# Altium schematic sheet Shutdown.SchDoc
size Tabloid; SheetNumber: 3; SheetTotal: 4
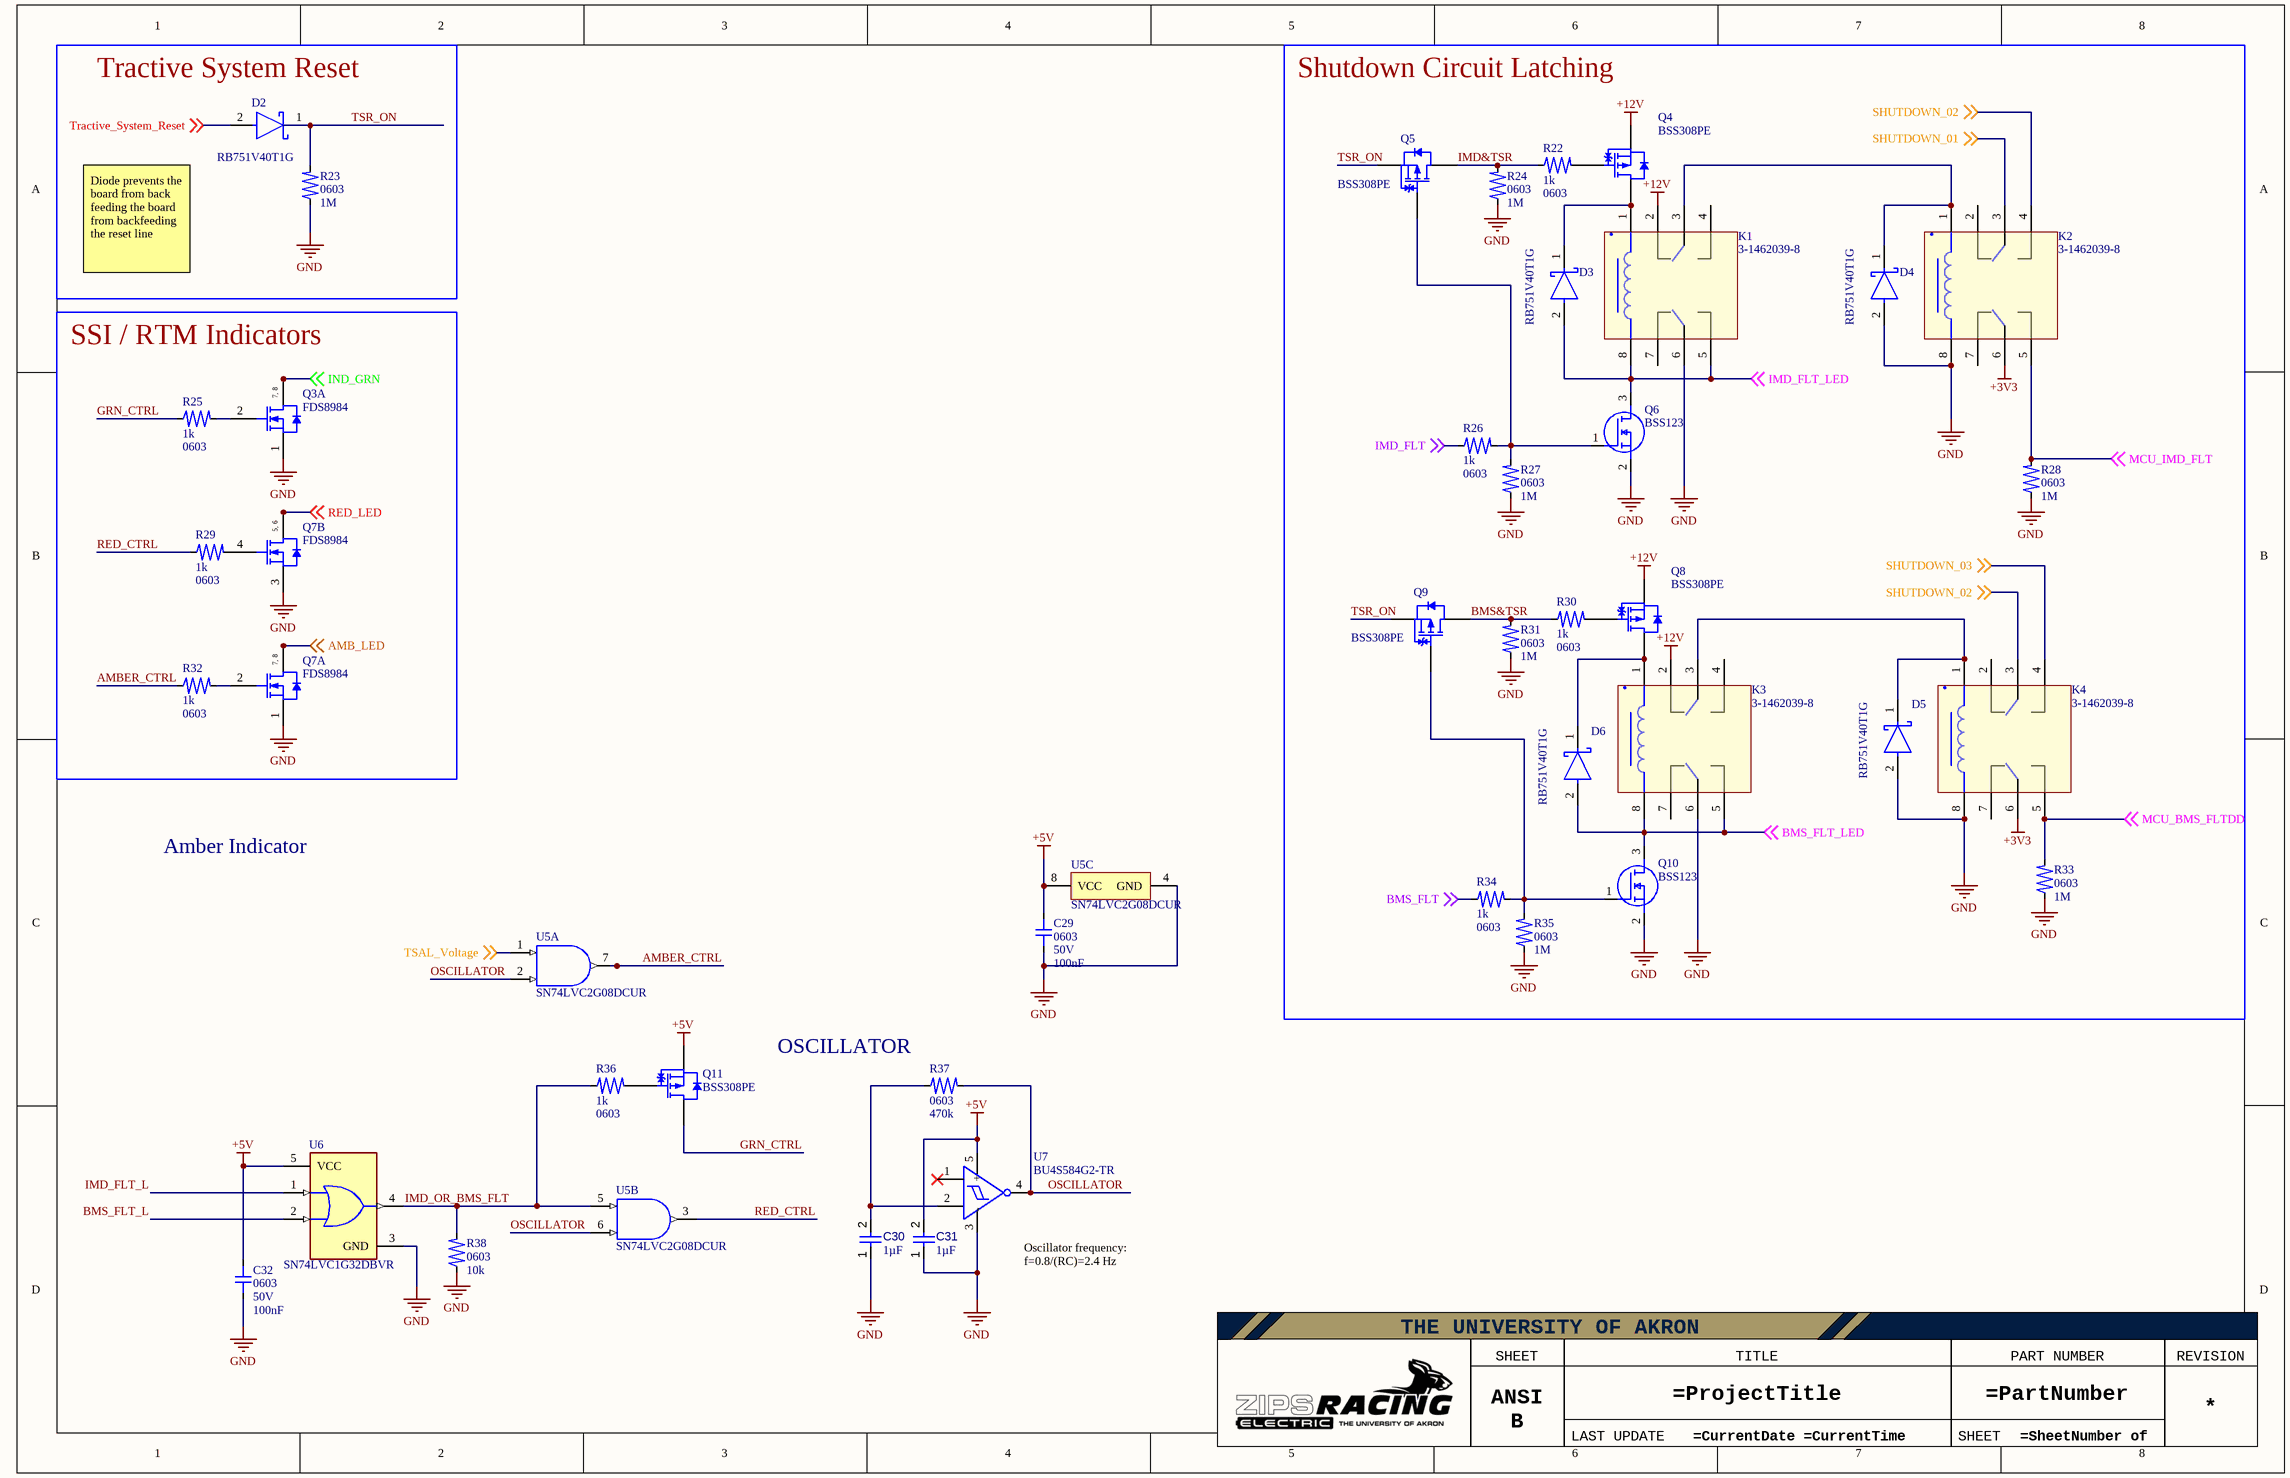
[diagram p0: Shutdown.SchDoc]

## Parts
C29  value 100nF  Footprint: 0603  Voltage: 50V  [CAP-0603-Generic]  (hidden comment: Capacitor 100nF 0603 5%)
C30  value 1µF  [CAPC1608X94X35NL15T15]  (hidden comment: Capacitor 1 uF +/- 10% 16 V 0603)
C31  value 1µF  [CAPC1608X94X35NL15T15]  (hidden comment: Capacitor 1 uF +/- 10% 16 V 0603)
C32  value 100nF  Footprint: 0603  Voltage: 50V  [CAP-0603-Generic]  (hidden comment: Capacitor 100nF 0603 5%)
D2  RB751V40T1G  [FP-477-02-MFG]
D3  RB751V40T1G  [FP-477-02-MFG]
D4  RB751V40T1G  [FP-477-02-MFG]
D5  RB751V40T1G  [FP-477-02-MFG]
D6  RB751V40T1G  [FP-477-02-MFG]
K1  3-1462039-8  [FP-3-1462039-8-MFG]
K2  3-1462039-8  [FP-3-1462039-8-MFG]
K3  3-1462039-8  [FP-3-1462039-8-MFG]
K4  3-1462039-8  [FP-3-1462039-8-MFG]
Q3  FDS8984  [FAIR-SOIC-8_V]  (part A of 2)
Q4  BSS308PE  [INF-PG-SOT23_M]
Q5  BSS308PE  [INF-PG-SOT23_M]
Q6  BSS123  [SOT96P237X111-3N]
Q7  FDS8984  [FAIR-SOIC-8_V]  (parts A,B of 2)
Q8  BSS308PE  [INF-PG-SOT23_M]
Q9  BSS308PE  [INF-PG-SOT23_M]
Q10  BSS123  [SOT96P237X111-3N]
Q11  BSS308PE  [INF-PG-SOT23_M]
R22  value 1k  Footprint: 0603  [RES-0603-Generic]  (hidden comment: Resistor 1k 0603 1%)
R23  value 1M  Footprint: 0603  [RES-0603-Generic]  (hidden comment: Resistor 1M 0603 1%)
R24  value 1M  Footprint: 0603  [RES-0603-Generic]  (hidden comment: Resistor 1M 0603 1%)
R25  value 1k  Footprint: 0603  [RES-0603-Generic]  (hidden comment: Resistor 1k 0603 1%)
R26  value 1k  Footprint: 0603  [RES-0603-Generic]  (hidden comment: Resistor 1k 0603 1%)
R27  value 1M  Footprint: 0603  [RES-0603-Generic]  (hidden comment: Resistor 1M 0603 1%)
R28  value 1M  Footprint: 0603  [RES-0603-Generic]  (hidden comment: Resistor 1M 0603 1%)
R29  value 1k  Footprint: 0603  [RES-0603-Generic]  (hidden comment: Resistor 1k 0603 1%)
R30  value 1k  Footprint: 0603  [RES-0603-Generic]  (hidden comment: Resistor 1k 0603 1%)
R31  value 1M  Footprint: 0603  [RES-0603-Generic]  (hidden comment: Resistor 1M 0603 1%)
R32  value 1k  Footprint: 0603  [RES-0603-Generic]  (hidden comment: Resistor 1k 0603 1%)
R33  value 1M  Footprint: 0603  [RES-0603-Generic]  (hidden comment: Resistor 1M 0603 1%)
R34  value 1k  Footprint: 0603  [RES-0603-Generic]  (hidden comment: Resistor 1k 0603 1%)
R35  value 1M  Footprint: 0603  [RES-0603-Generic]  (hidden comment: Resistor 1M 0603 1%)
R36  value 1k  Footprint: 0603  [RES-0603-Generic]  (hidden comment: Resistor 1k 0603 1%)
R37  value 470k  Footprint: 0603  [RES-0603-Generic]  (hidden comment: Resistor 470k 0603 1%)
R38  value 10k  Footprint: 0603  [RES-0603-Generic]  (hidden comment: Resistor 10k 0603 1%)
U5  SN74LVC2G08DCUR  [DCU0008A_N]  (parts A,B,C of 3)
U6  SN74LVC1G32DBVR  [FP-DBV0005A-MFG]
U7  BU4S584G2-TR  [SSOP5_ROM]

## Blocks framed on the sheet
Tractive System Reset: D2 R23
Shutdown Circuit Latching: D3-D6 K1-K4 Q4-Q6 Q8-Q10 R22 R24 R26-R28 R30 R31 R33-R35
SSI / RTM Indicators: Q3 Q7 R25 R29 R32

## Nets
+3V3: K2.6 K4.6
+5V: C29.2 C31.2 C32.2 Q11.2(SOURCE) U5.8(VCC) U6.5(VCC) U7.5(+)
+12V: K1.2 K3.2 Q4.2(SOURCE) Q8.2(SOURCE)
GND: C29.1 C30.1 C31.1 C32.1 D4.2(A) D5.2(A) K1.6 K2.8 K3.6 K4.8 Q3.1(S1) Q6.2(S) Q7.1(S1) Q7.3(S2) Q10.2(S) R23.1 R24.1 R27.1 R28.1 R31.1 R33.1 R35.1 R38.1 U5.4(GND) U6.3(GND) U7.3(-)
AMB_LED: Q7.7(D1) Q7.8(D1) ; off-sheet AMB_LED
AMBER_CTRL: R32.1 U5.7(1Y)
BMS&TSR: Q9.3(DRAIN) R30.1 R31.2
BMS_FLT: R34.1 ; off-sheet BMS_FLT
BMS_FLT_L: U6.2(B)
BMS_FLT_LED: D6.2(A) K3.5 K3.8 Q10.3(D) ; off-sheet BMS_FLT_LED
GRN_CTRL: Q11.3(DRAIN) R25.1
IMD&TSR: Q5.3(DRAIN) R22.1 R24.2
IMD_FLT: R26.1 ; off-sheet IMD_FLT
IMD_FLT_L: U6.1(A)
IMD_FLT_LED: D3.2(A) K1.5 K1.8 Q6.3(D) ; off-sheet IMD_FLT_LED
IMD_OR_BMS_FLT: R36.1 R38.2 U5.5(2A) U6.4(Y)
IND_GRN: Q3.7(D1) Q3.8(D1) ; off-sheet IND_GRN
MCU_BMS_FLTDD: K4.5 R33.2 ; off-sheet MCU_BMS_FLTDD
MCU_IMD_FLT: K2.5 R28.2 ; off-sheet MCU_IMD_FLT
OSCILLATOR: R37.2 U5.2(1B) U5.6(2B) U7.4
RED_CTRL: R29.1 U5.3(2Y)
RED_LED: Q7.5(D2) Q7.6(D2) ; off-sheet RED_LED
SHUTDOWN_01: K2.3 ; off-sheet SHUTDOWN_01
SHUTDOWN_02: K2.4 K4.3 ; off-sheet SHUTDOWN_02
SHUTDOWN_03: K4.4 ; off-sheet SHUTDOWN_03
Tractive_System_Reset: D2.2(A) ; off-sheet Tractive_System_Reset
TSAL_Voltage: U5.1(1A) ; off-sheet TSAL_Voltage
TSR_ON: D2.1(C) Q5.2(SOURCE) Q9.2(SOURCE) R23.2
NetC30_2: C30.2 R37.1 U7.2
NetD3_1: D3.1(C) K1.1 Q4.3(DRAIN)
NetD4_1: D4.1(C) K1.3 K2.1
NetD5_1: D5.1(C) K3.3 K4.1
NetD6_1: D6.1(C) K3.1 Q8.3(DRAIN)
NetQ3_2: Q3.2(G1) R25.2
NetQ4_1: Q4.1(GATE) R22.2
NetQ5_1: Q5.1(GATE) Q6.1(G) R26.2 R27.2
NetQ7_2: Q7.2(G1) R32.2
NetQ7_4: Q7.4(G2) R29.2
NetQ8_1: Q8.1(GATE) R30.2
NetQ9_1: Q9.1(GATE) Q10.1(G) R34.2 R35.2
NetQ11_1: Q11.1(GATE) R36.2

Not connected (* = marked no-connect by the designer): K1 4 7; K2 2 7; K3 4 7; K4 2 7; U7 1(NC)*

## Notes on the sheet
- Diode prevents the board from back feeding the board from backfeeding the reset line
- Amber Indicator
- (near R37) OSCILLATOR
- (near U7) Oscillator frequency:
  f=0.8/(RC)=2.4 Hz
- THE UNIVERSITY OF AKRON
- SHEET SIZE
- TITLE
- PART NUMBER
- REVISION
- ANSI B
- LAST UPDATE
- SHEET
- (in symbol CMP-008-00010-2) .
- (in symbol CMP-013-00045-1, part A) 7, 8
- (in symbol CMP-013-00045-1, part B) 5, 6

## Library data of the parts
C29 C32 = CMP-00030-2: Capacitor, 0603, 5%; Max Operating Temperature: 125°C; Min Operating Temperature: -55°C
C30 C31 = CMP-001-00003-6: Chip Capacitor, 1 uF, +/- 10%, 16 V, 0603 (1608 Metric); Voltage Rating: 16V; Capacitor Type: Ceramic; Max Operating Temperature: 125°C; Pins: 2; Tolerance: 10%; Min Operating Temperature: -55°C; RoHS Compliant: True; Mounting Technology: SM; Case/Package: 0603
D2-D6 = CMP-004-00075-1: Rectifier Diode, Schottky, 1 Phase, 1 Element, 0.03A, 40V V(RRM), Silicon; Forward Voltage: 370mV; Pins: 2; RoHS Compliant: Yes; Max Operating Temperature: 150°C; Min Operating Temperature: -55°C
K1-K4 = CMP-008-00010-2: Power/Signal Relay, 2 Form C, DPDT, Momentary, 0.01A (Coil), 12VDC (Coil), 140mW (Coil), 5A (Contact), 220VDC (Contact), DC Input, Random, AC/DC Output, Through Hole-Straight Mount; Operate Time: 3ms; Mounting Technology: Through-hole; Pins: 8; Max Operating Temperature: 85°C; Current Rating: 5A; Min Operating Temperature: -40°C; Contact Form: DPDT; RoHS Compliant: Yes; ComponentLink1URL: https://www.te.com/commerce/DocumentDelivery/DDEController?Action=srchrtrv&DocNm=108-98001&DocType=Data+Sheet&DocLang=English&DocFormat=pdf&PartCntxt=3-1462039-8; ComponentLink1Description: Datasheet
Q3 Q7 = CMP-013-00045-1: Power Field-Effect Transistor, 7A I(D), 30V, 0.032ohm, 2-Element, N-Channel, Silicon, Metal-oxide Semiconductor FET; Max Operating Temperature: 150°C; Pins: 8; RoHS Compliant: Yes
Q4 Q5 Q8 Q9 Q11 = CMP-013-00040-1: Small Signal Field-Effect Transistor, 2A I(D), 30V, 1-Element, P-Channel, Silicon, Metal-oxide Semiconductor FET; Pins: 3; RoHS Compliant: Yes
Q6 Q10 = CMP-023-000002-1: MOSFET N-CH 100V 170MA SOT23-3; Manufacturer_Name: ON Semiconductor; Datasheet Link: http://uk.rs-online.com/web/p/products/6710321; Mouser Price/Stock: https://www.mouser.co.uk/ProductDetail/ON-Semiconductor-Fairchild/BSS123?qs=FOlmdCx%252BAA2Kf8SEB3qLYA%3D%3D; Arrow Part Number: BSS123; Arrow Price/Stock: https://www.arrow.com/en/products/bss123/on-semiconductor; Manufacturer_Part_Number: BSS123; Source: Zips_Racing_Electric.SchLib; Design Item ID: BSS123; Height: 1.11mm; Mouser Part Number: 512-BSS123
R22 R25 R26 R29 R30 R32 R34 R36 = CMP-00021-7: Resistor, 0603, 1k; Power: 100mW; Max Operating Temperature: 155°C; Min Operating Temperature: -55°C; Datasheet: https://www.seielect.com/catalog/sei-rmcf_rmcp.pdf; Tolerance: 1%
R23 R24 R27 R28 R31 R33 R35 = CMP-00041-2: Resistor, 0603, 1%, 1/10W; Power: 100mW; Tolerance: 1%; Datasheet: https://www.seielect.com/catalog/sei-rmcf_rmcp.pdf; Max Operating Temperature: 155°C; Min Operating Temperature: -55°C
R37 = CMP-00018-2: Resistor, 0603, 1%, 1/10W; Power: 100mW; Min Operating Temperature: -55°C; Tolerance: 1%; Datasheet: https://www.seielect.com/catalog/sei-rmcf_rmcp.pdf; Max Operating Temperature: 155°C
R38 = CMP-00020-12: Resistor, 0603, 10k; Power: 100mW; Minimum Operating Temperature: -55°C; Tolerance: 1%; Maximum Operating Temperature: 155°C; Max Operating Temperature: 155°C; Min Operating Temperature: -55°C; Datasheet: https://www.seielect.com/catalog/sei-rmcf_rmcp.pdf
U5 = CMP-016-00027-1: AND Gate, LVC/LCX/Z Series, 2-Func, 2-Input, CMOS, PDSO8; Min Supply Voltage: 1.65V; Max Supply Voltage: 5.5V; Nominal Supply Voltage: 1.8V; RoHS Compliant: Yes; Case/Package: VSSOP; Pins: 8; Min Operating Temperature: -40°C; Logic Type: AND GATE; Max Operating Temperature: 125°C
U6 = CMP-016-00020-1: OR Gate, LVC/LCX/Z Series, 1-Func, 2-Input, CMOS, PDSO5; Min Supply Voltage: 1.65V; Logic Type: OR GATE; Nominal Supply Voltage: 3.3V; Max Supply Voltage: 5.5V; Min Operating Temperature: -40°C; Max Operating Temperature: 125°C; Pins: 5; Case/Package: LSSOP; RoHS Compliant: Yes
U7 = CMP-031-00016-1: Inverter IC 1 Channel Schmitt Trigger 5-SSOP; Mfr_Name: ROHM Semiconductor; Manufacturer_Part_Number: BU4S584G2-TR; Copyright: Copyright (C) 2021 Ultra Librarian. All rights reserved.; Design Item ID: BU4S584G2-TR; RefDes: RefDes; Digi-Key_Part_Number_1: BU4S584G2TR-ND; Type: DEV; Digi-Key_Part_Number_2: BU4S584G2CT-ND; Source: Zips_Racing_Electric.SchLib; Digi-Key_Part_Number_3: BU4S584G2DKR-ND